# EAGLE schematic A314-600_v1.0 (EAGLE 7.7.0)

## Sheet 1 of 5: AMIGA Interface
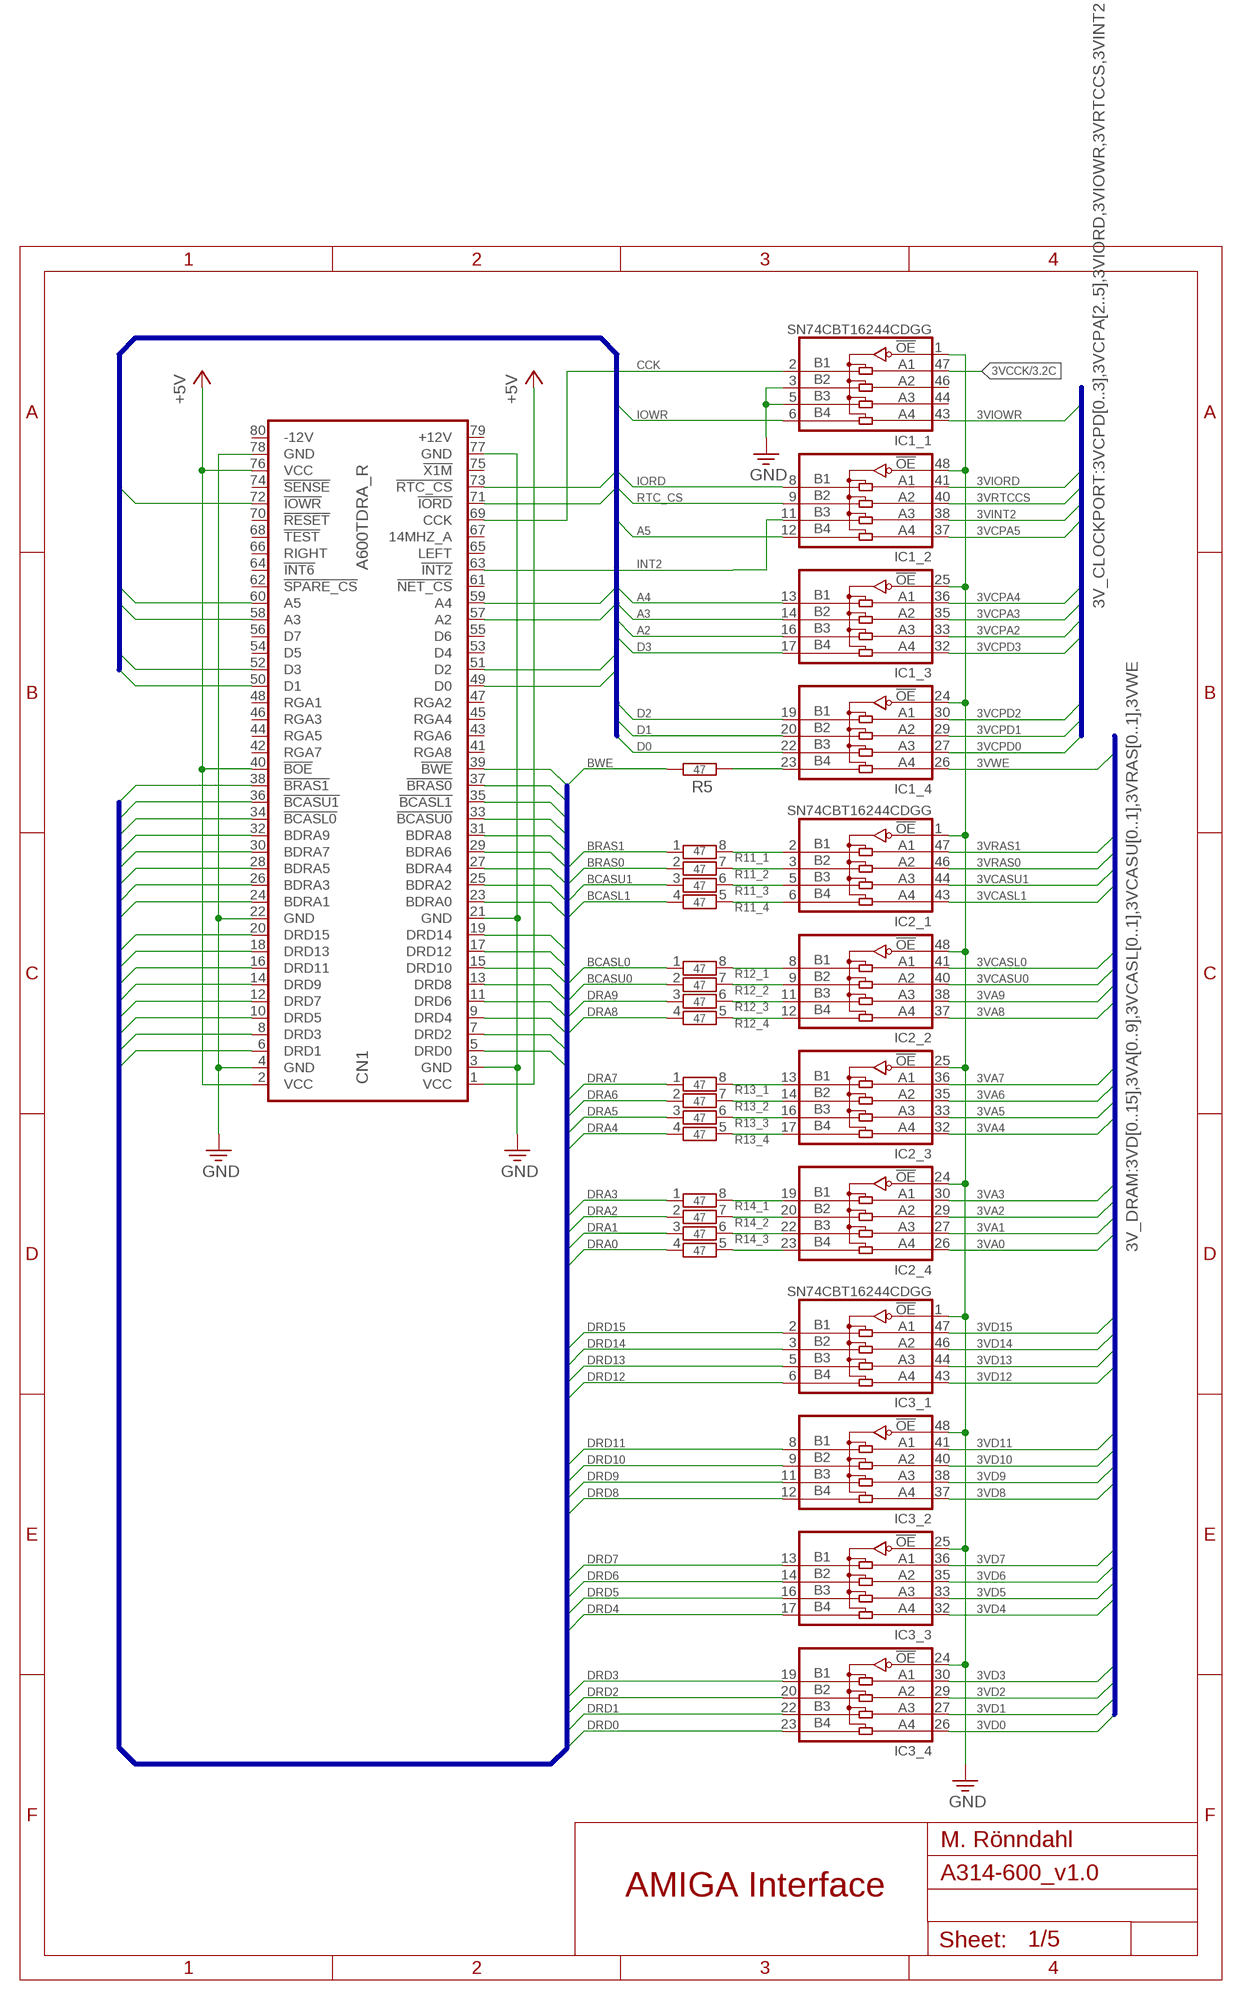
[diagram p0: schematic, sheet 1]

### Parts
CN1  A600TDRA_R  [CE-2X40_1.27_R]
IC1  SN74CBT16244CDGG  [PSOP-DGG48]
IC2  SN74CBT16244CDGG  [PSOP-DGG48]
IC3  SN74CBT16244CDGG  [PSOP-DGG48]
R5  47  R-EU_R0603  [R0603]
R11  47  CTS742C083_S  [CTS742C083]
R12  47  CTS742C083_S  [CTS742C083]
R13  47  CTS742C083_S  [CTS742C083]
R14  47  CTS742C083_S  [CTS742C083]

### Nets
3VA0: IC2.26(_4:A4) ; also sheet 3
3VA1: IC2.27(_4:A3) ; also sheet 3
3VA2: IC2.29(_4:A2) ; also sheet 3
3VA3: IC2.30(_4:A1) ; also sheet 3
3VA4: IC2.32(_3:A4) ; also sheet 3
3VA5: IC2.33(_3:A3) ; also sheet 3
3VA6: IC2.35(_3:A2) ; also sheet 3
3VA7: IC2.36(_3:A1) ; also sheet 3
3VA8: IC2.37(_2:A4) ; also sheet 3
3VA9: IC2.38(_2:A3) ; also sheet 3
3VCASL0: IC2.41(_2:A1) ; also sheet 3
3VCASL1: IC2.43(_1:A4) ; also sheet 3
3VCASU0: IC2.40(_2:A2) ; also sheet 3
3VCASU1: IC2.44(_1:A3) ; also sheet 3
3VCCK: IC1.47(_1:A1) ; also sheet 3
3VCPA2: IC1.33(_3:A3) ; also sheet 3
3VCPA3: IC1.35(_3:A2) ; also sheet 3
3VCPA4: IC1.36(_3:A1) ; also sheet 3
3VCPA5: IC1.37(_2:A4) ; also sheet 3
3VCPD0: IC1.27(_4:A3) ; also sheet 3
3VCPD1: IC1.29(_4:A2) ; also sheet 3
3VCPD2: IC1.30(_4:A1) ; also sheet 3
3VCPD3: IC1.32(_3:A4) ; also sheet 3
3VD0: IC3.26(_4:A4) ; also sheet 3
3VD1: IC3.27(_4:A3) ; also sheet 3
3VD2: IC3.29(_4:A2) ; also sheet 3
3VD3: IC3.30(_4:A1) ; also sheet 3
3VD4: IC3.32(_3:A4) ; also sheet 3
3VD5: IC3.33(_3:A3) ; also sheet 3
3VD6: IC3.35(_3:A2) ; also sheet 3
3VD7: IC3.36(_3:A1) ; also sheet 3
3VD8: IC3.37(_2:A4) ; also sheet 3
3VD9: IC3.38(_2:A3) ; also sheet 3
3VD10: IC3.40(_2:A2) ; also sheet 3
3VD11: IC3.41(_2:A1) ; also sheet 3
3VD12: IC3.43(_1:A4) ; also sheet 3
3VD13: IC3.44(_1:A3) ; also sheet 3
3VD14: IC3.46(_1:A2) ; also sheet 3
3VD15: IC3.47(_1:A1) ; also sheet 3
3VINT2: IC1.38(_2:A3) ; also sheet 3
3VIORD: IC1.41(_2:A1) ; also sheet 3
3VIOWR: IC1.43(_1:A4) ; also sheet 3
3VRAS0: IC2.46(_1:A2) ; also sheet 3
3VRAS1: IC2.47(_1:A1) ; also sheet 3
3VRTCCS: IC1.40(_2:A2) ; also sheet 3
3VWE: IC1.26(_4:A4) ; also sheet 3
+5V: CN1.1(VCC) CN1.2(VCC) CN1.40(!BOE) CN1.76(VCC) ; also sheet 3,4,5
A2: CN1.57(A2) IC1.16(_3:B3)
A3: CN1.58(A3) IC1.14(_3:B2)
A4: CN1.59(A4) IC1.13(_3:B1)
A5: CN1.60(A5) IC1.12(_2:B4)
BCASL0: CN1.34(!BCASL0) R12.1
BCASL1: CN1.35(!BCASL1) R11.4
BCASU0: CN1.33(!BCASU0) R12.2
BCASU1: CN1.36(!BCASU1) R11.3
BRAS0: CN1.37(!BRAS0) R11.2
BRAS1: CN1.38(!BRAS1) R11.1
BWE: CN1.39(!BWE) R5.1
CCK: CN1.69(CCK) IC1.2(_1:B1)
D0: CN1.49(D0) IC1.22(_4:B3)
D1: CN1.50(D1) IC1.20(_4:B2)
D2: CN1.51(D2) IC1.19(_4:B1)
D3: CN1.52(D3) IC1.17(_3:B4)
DRA0: CN1.23(BDRA0) R14.4
DRA1: CN1.24(BDRA1) R14.3
DRA2: CN1.25(BDRA2) R14.2
DRA3: CN1.26(BDRA3) R14.1
DRA4: CN1.27(BDRA4) R13.4
DRA5: CN1.28(BDRA5) R13.3
DRA6: CN1.29(BDRA6) R13.2
DRA7: CN1.30(BDRA7) R13.1
DRA8: CN1.31(BDRA8) R12.4
DRA9: CN1.32(BDRA9) R12.3
DRD0: CN1.5(DRD0) IC3.23(_4:B4)
DRD1: CN1.6(DRD1) IC3.22(_4:B3)
DRD2: CN1.7(DRD2) IC3.20(_4:B2)
DRD3: CN1.8(DRD3) IC3.19(_4:B1)
DRD4: CN1.9(DRD4) IC3.17(_3:B4)
DRD5: CN1.10(DRD5) IC3.16(_3:B3)
DRD6: CN1.11(DRD6) IC3.14(_3:B2)
DRD7: CN1.12(DRD7) IC3.13(_3:B1)
DRD8: CN1.13(DRD8) IC3.12(_2:B4)
DRD9: CN1.14(DRD9) IC3.11(_2:B3)
DRD10: CN1.15(DRD10) IC3.9(_2:B2)
DRD11: CN1.16(DRD11) IC3.8(_2:B1)
DRD12: CN1.17(DRD12) IC3.6(_1:B4)
DRD13: CN1.18(DRD13) IC3.5(_1:B3)
DRD14: CN1.19(DRD14) IC3.3(_1:B2)
DRD15: CN1.20(DRD15) IC3.2(_1:B1)
GND: CN1.3(GND) CN1.4(GND) CN1.21(GND) CN1.22(GND) CN1.77(GND) CN1.78(GND) IC1.1(_1:!OE) IC1.3(_1:B2) IC1.5(_1:B3) IC1.24(_4:!OE) IC1.25(_3:!OE) IC1.48(_2:!OE) IC2.1(_1:!OE) IC2.24(_4:!OE) IC2.25(_3:!OE) IC2.48(_2:!OE) IC3.1(_1:!OE) IC3.24(_4:!OE) IC3.25(_3:!OE) IC3.48(_2:!OE) ; also sheet 2,3,4,5
INT2: CN1.63(!INT2) IC1.11(_2:B3)
IORD: CN1.71(!IORD) IC1.8(_2:B1)
IOWR: CN1.72(!IOWR) IC1.6(_1:B4)
N$5: IC2.23(_4:B4) R14.5
N$31: IC2.22(_4:B3) R14.6
N$32: IC2.20(_4:B2) R14.7
N$33: IC2.19(_4:B1) R14.8
N$34: IC2.17(_3:B4) R13.5
N$35: IC2.16(_3:B3) R13.6
N$42: IC2.14(_3:B2) R13.7
N$43: IC2.13(_3:B1) R13.8
N$44: IC2.12(_2:B4) R12.5
N$45: IC2.11(_2:B3) R12.6
N$46: IC2.9(_2:B2) R12.7
N$47: IC2.8(_2:B1) R12.8
N$48: IC2.6(_1:B4) R11.5
N$49: IC2.5(_1:B3) R11.6
N$50: IC2.3(_1:B2) R11.7
N$51: IC2.2(_1:B1) R11.8
N$52: IC1.23(_4:B4) R5.2
RTC_CS: CN1.73(!RTC_CS) IC1.9(_2:B2)
Unconnected: CN1.41(RGA8) CN1.42(RGA7) CN1.43(RGA6) CN1.44(RGA5) CN1.45(RGA4) CN1.46(RGA3) CN1.47(RGA2) CN1.48(RGA1) CN1.53(D4) CN1.54(D5) CN1.55(D6) CN1.56(D7) CN1.61(!NET_CS) CN1.62(!SPARE_CS) CN1.64(!INT6) CN1.65(LEFT) CN1.66(RIGHT) CN1.67(14MHZ_A) CN1.68(!TEST) CN1.70(!RESET) CN1.74(!SENSE) CN1.75(!X1M) CN1.79(+12V) CN1.80(-12V) IC1.44(_1:A3) IC1.46(_1:A2)

### Buses
CLK:A[2..5],D[0..3],IORD,IOWR,RTC_CS
MEM:DRA[0..9],DRD[0..15],BRAS[0..1],BCASU[0..1],BCASL[0..1],BWE
3V_DRAM:3VD[0..15],3VA[0..9],3VCASL[0..1],3VCASU[0..1],3VRAS[0..1],3VWE
3V_CLOCKPORT:3VCPD[0..3],3VCPA[2..5],3VIORD,3VIOWR,3VRTCCS,3VINT2

### Notes on the sheet
- M. Rönndahl
- AMIGA Interface

## Sheet 2 of 5: SRAM & RTC
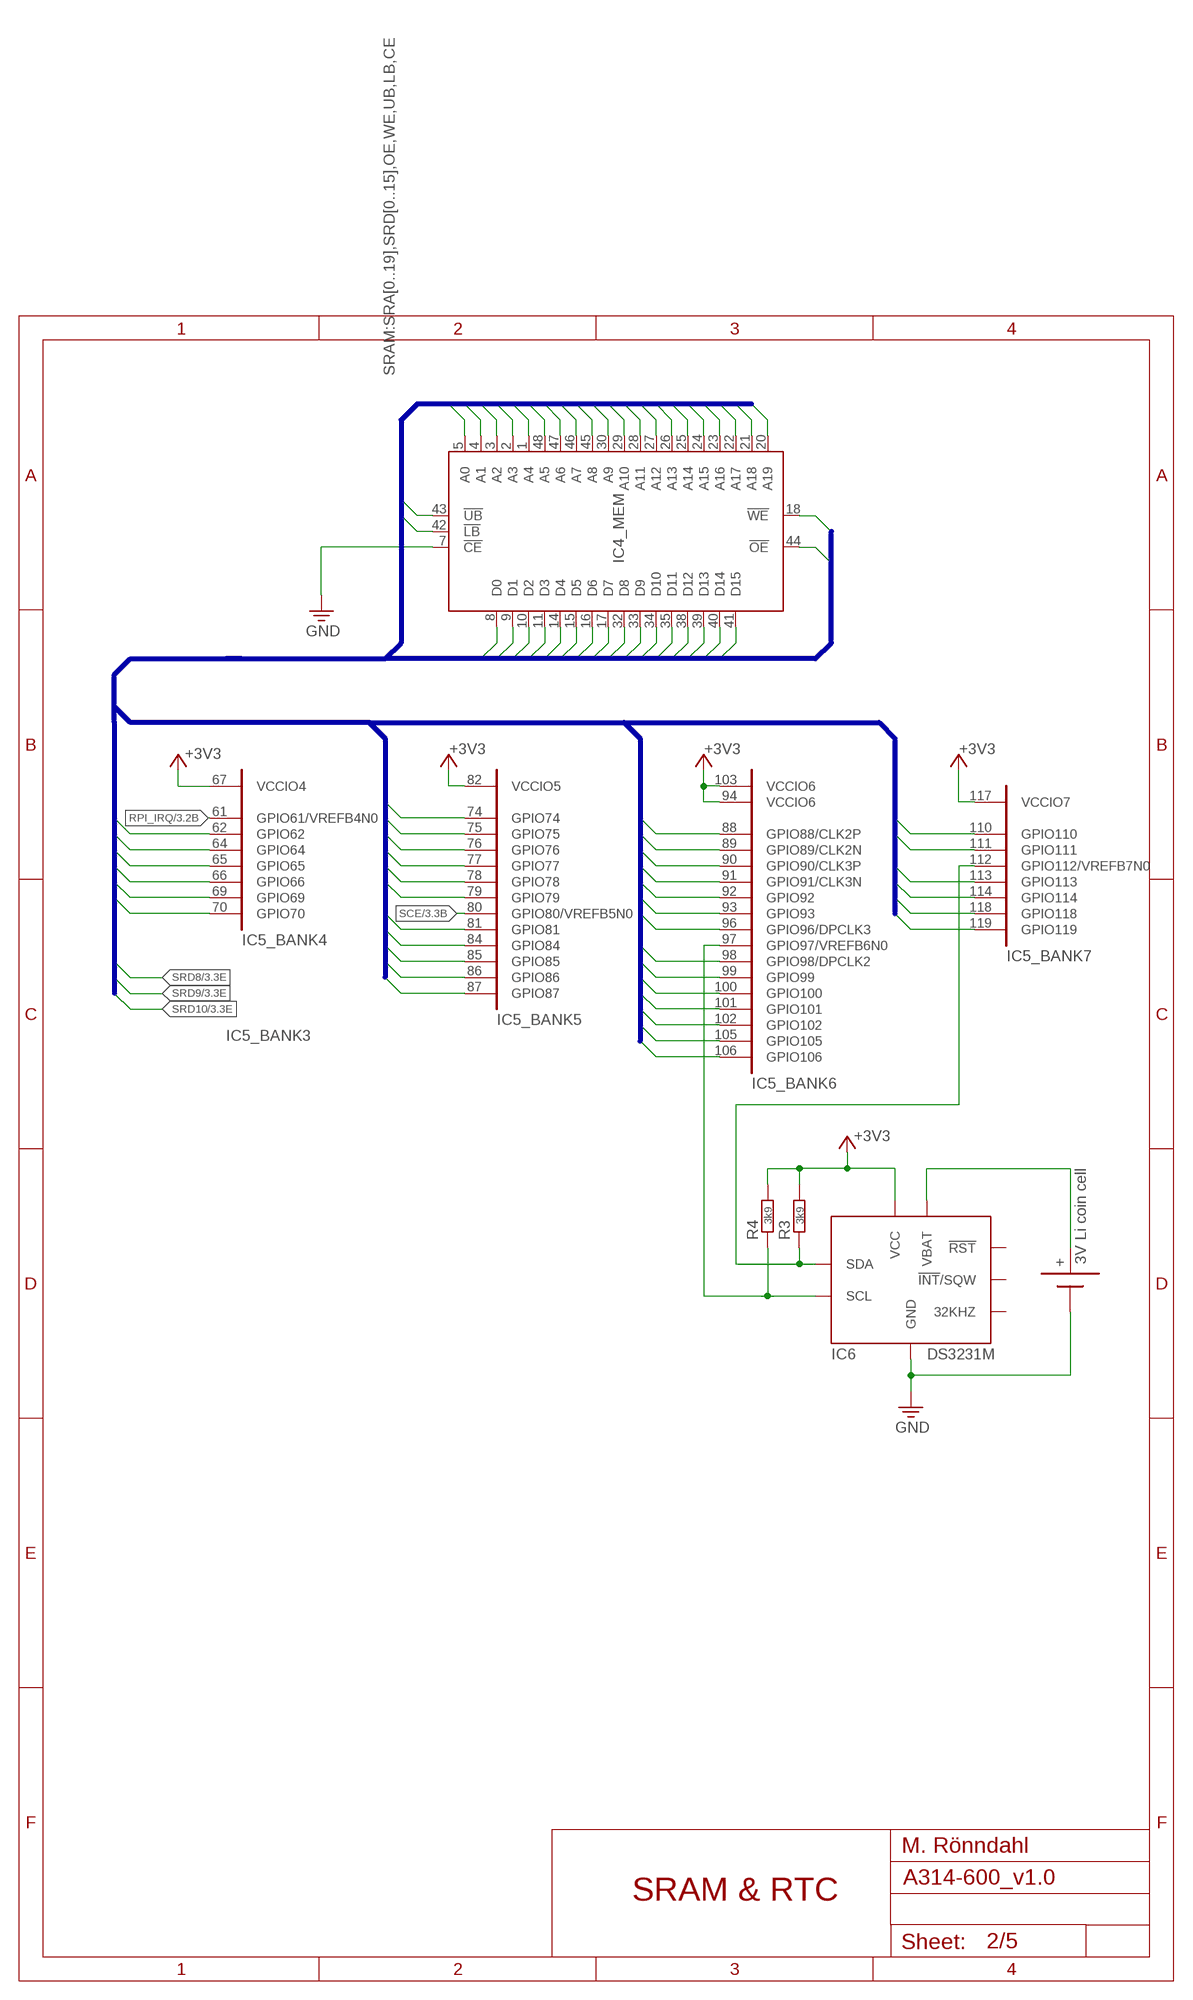
[diagram p1: schematic, sheet 2]

### Parts
BAT1  CR2025/CR2032TH  [LINX20XX-THM]
IC4  IS61WV102416FBLL-TLI  [TSOP-1_48L_12X20]
IC5  10M08SCE144  [SQFP-S-20X20-144]
IC6  DS3231M  [SOIC8]
R3  3k9  R-EU_R0603  [R0603]
R4  3k9  R-EU_R0603  [R0603]

### Nets
+: BAT1.+@1(+) BAT1.+@2(+) BAT1.+@3(+) BAT1.+@4(+) IC6.6(VBAT)
+3V3: IC5.67(_BANK4:VCCIO4) IC5.82(_BANK5:VCCIO5) IC5.94(_BANK6:VCCIO6) IC5.103(_BANK6:VCCIO6) IC5.117(_BANK7:VCCIO7) IC6.2(VCC) R3.2 R4.2 ; also sheet 3,5
GND: BAT1.GND(-) IC4.7(_MEM:!CE) IC6.5(GND) ; also sheet 1,3,4,5
LB: IC4.42(_MEM:!LB) IC5.79(_BANK5:GPIO79)
OE: IC4.44(_MEM:!OE) IC5.84(_BANK5:GPIO84)
RPI_IRQ: IC5.61(_BANK4:GPIO61/VREFB4N0) ; also sheet 3
RTC_SCL: IC5.97(_BANK6:GPIO97/VREFB6N0) IC6.8(SCL) R4.1
RTC_SDA: IC5.112(_BANK7:GPIO112/VREFB7N0) IC6.7(SDA) R3.1
SCE: IC5.80(_BANK5:GPIO80/VREFB5N0) ; also sheet 3
SRA0: IC4.5(_MEM:A0) IC5.93(_BANK6:GPIO93)
SRA1: IC4.4(_MEM:A1) IC5.92(_BANK6:GPIO92)
SRA2: IC4.3(_MEM:A2) IC5.91(_BANK6:GPIO91/CLK3N)
SRA3: IC4.2(_MEM:A3) IC5.90(_BANK6:GPIO90/CLK3P)
SRA4: IC4.1(_MEM:A4) IC5.89(_BANK6:GPIO89/CLK2N)
SRA5: IC4.48(_MEM:A5) IC5.88(_BANK6:GPIO88/CLK2P)
SRA6: IC4.47(_MEM:A6) IC5.87(_BANK5:GPIO87)
SRA7: IC4.46(_MEM:A7) IC5.86(_BANK5:GPIO86)
SRA8: IC4.45(_MEM:A8) IC5.85(_BANK5:GPIO85)
SRA9: IC4.30(_MEM:A9) IC5.62(_BANK4:GPIO62)
SRA10: IC4.29(_MEM:A10) IC5.64(_BANK4:GPIO64)
SRA11: IC4.28(_MEM:A11) IC5.65(_BANK4:GPIO65)
SRA12: IC4.27(_MEM:A12) IC5.66(_BANK4:GPIO66)
SRA13: IC4.26(_MEM:A13) IC5.69(_BANK4:GPIO69)
SRA14: IC4.25(_MEM:A14) IC5.70(_BANK4:GPIO70)
SRA15: IC4.24(_MEM:A15) IC5.110(_BANK7:GPIO110)
SRA16: IC4.23(_MEM:A16) IC5.111(_BANK7:GPIO111)
SRA17: IC4.22(_MEM:A17) IC5.113(_BANK7:GPIO113)
SRA18: IC4.21(_MEM:A18) IC5.114(_BANK7:GPIO114)
SRA19: IC4.20(_MEM:A19) IC5.118(_BANK7:GPIO118)
SRD0: IC4.8(_MEM:D0) IC5.96(_BANK6:GPIO96/DPCLK3)
SRD1: IC4.9(_MEM:D1) IC5.98(_BANK6:GPIO98/DPCLK2)
SRD2: IC4.10(_MEM:D2) IC5.99(_BANK6:GPIO99)
SRD3: IC4.11(_MEM:D3) IC5.100(_BANK6:GPIO100)
SRD4: IC4.14(_MEM:D4) IC5.101(_BANK6:GPIO101)
SRD5: IC4.15(_MEM:D5) IC5.102(_BANK6:GPIO102)
SRD6: IC4.16(_MEM:D6) IC5.105(_BANK6:GPIO105)
SRD7: IC4.17(_MEM:D7) IC5.106(_BANK6:GPIO106)
SRD8: IC4.32(_MEM:D8) ; also sheet 3
SRD9: IC4.33(_MEM:D9) ; also sheet 3
SRD10: IC4.34(_MEM:D10) ; also sheet 3
SRD11: IC4.35(_MEM:D11) IC5.74(_BANK5:GPIO74)
SRD12: IC4.38(_MEM:D12) IC5.75(_BANK5:GPIO75)
SRD13: IC4.39(_MEM:D13) IC5.76(_BANK5:GPIO76)
SRD14: IC4.40(_MEM:D14) IC5.77(_BANK5:GPIO77)
SRD15: IC4.41(_MEM:D15) IC5.78(_BANK5:GPIO78)
UB: IC4.43(_MEM:!UB) IC5.81(_BANK5:GPIO81)
WE: IC4.18(_MEM:!WE) IC5.119(_BANK7:GPIO119)
Unconnected: IC6.1(32KHZ) IC6.3(!INT!/SQW) IC6.4(!RST)

### Buses
SRAM:SRA[0..19],SRD[0..15],OE,WE,UB,LB,CE

### Notes on the sheet
- IC5_BANK3
- 3V Li coin cell
- M. Rönndahl
- SRAM & RTC

## Sheet 3 of 5: Raspberry & DRAM Bus
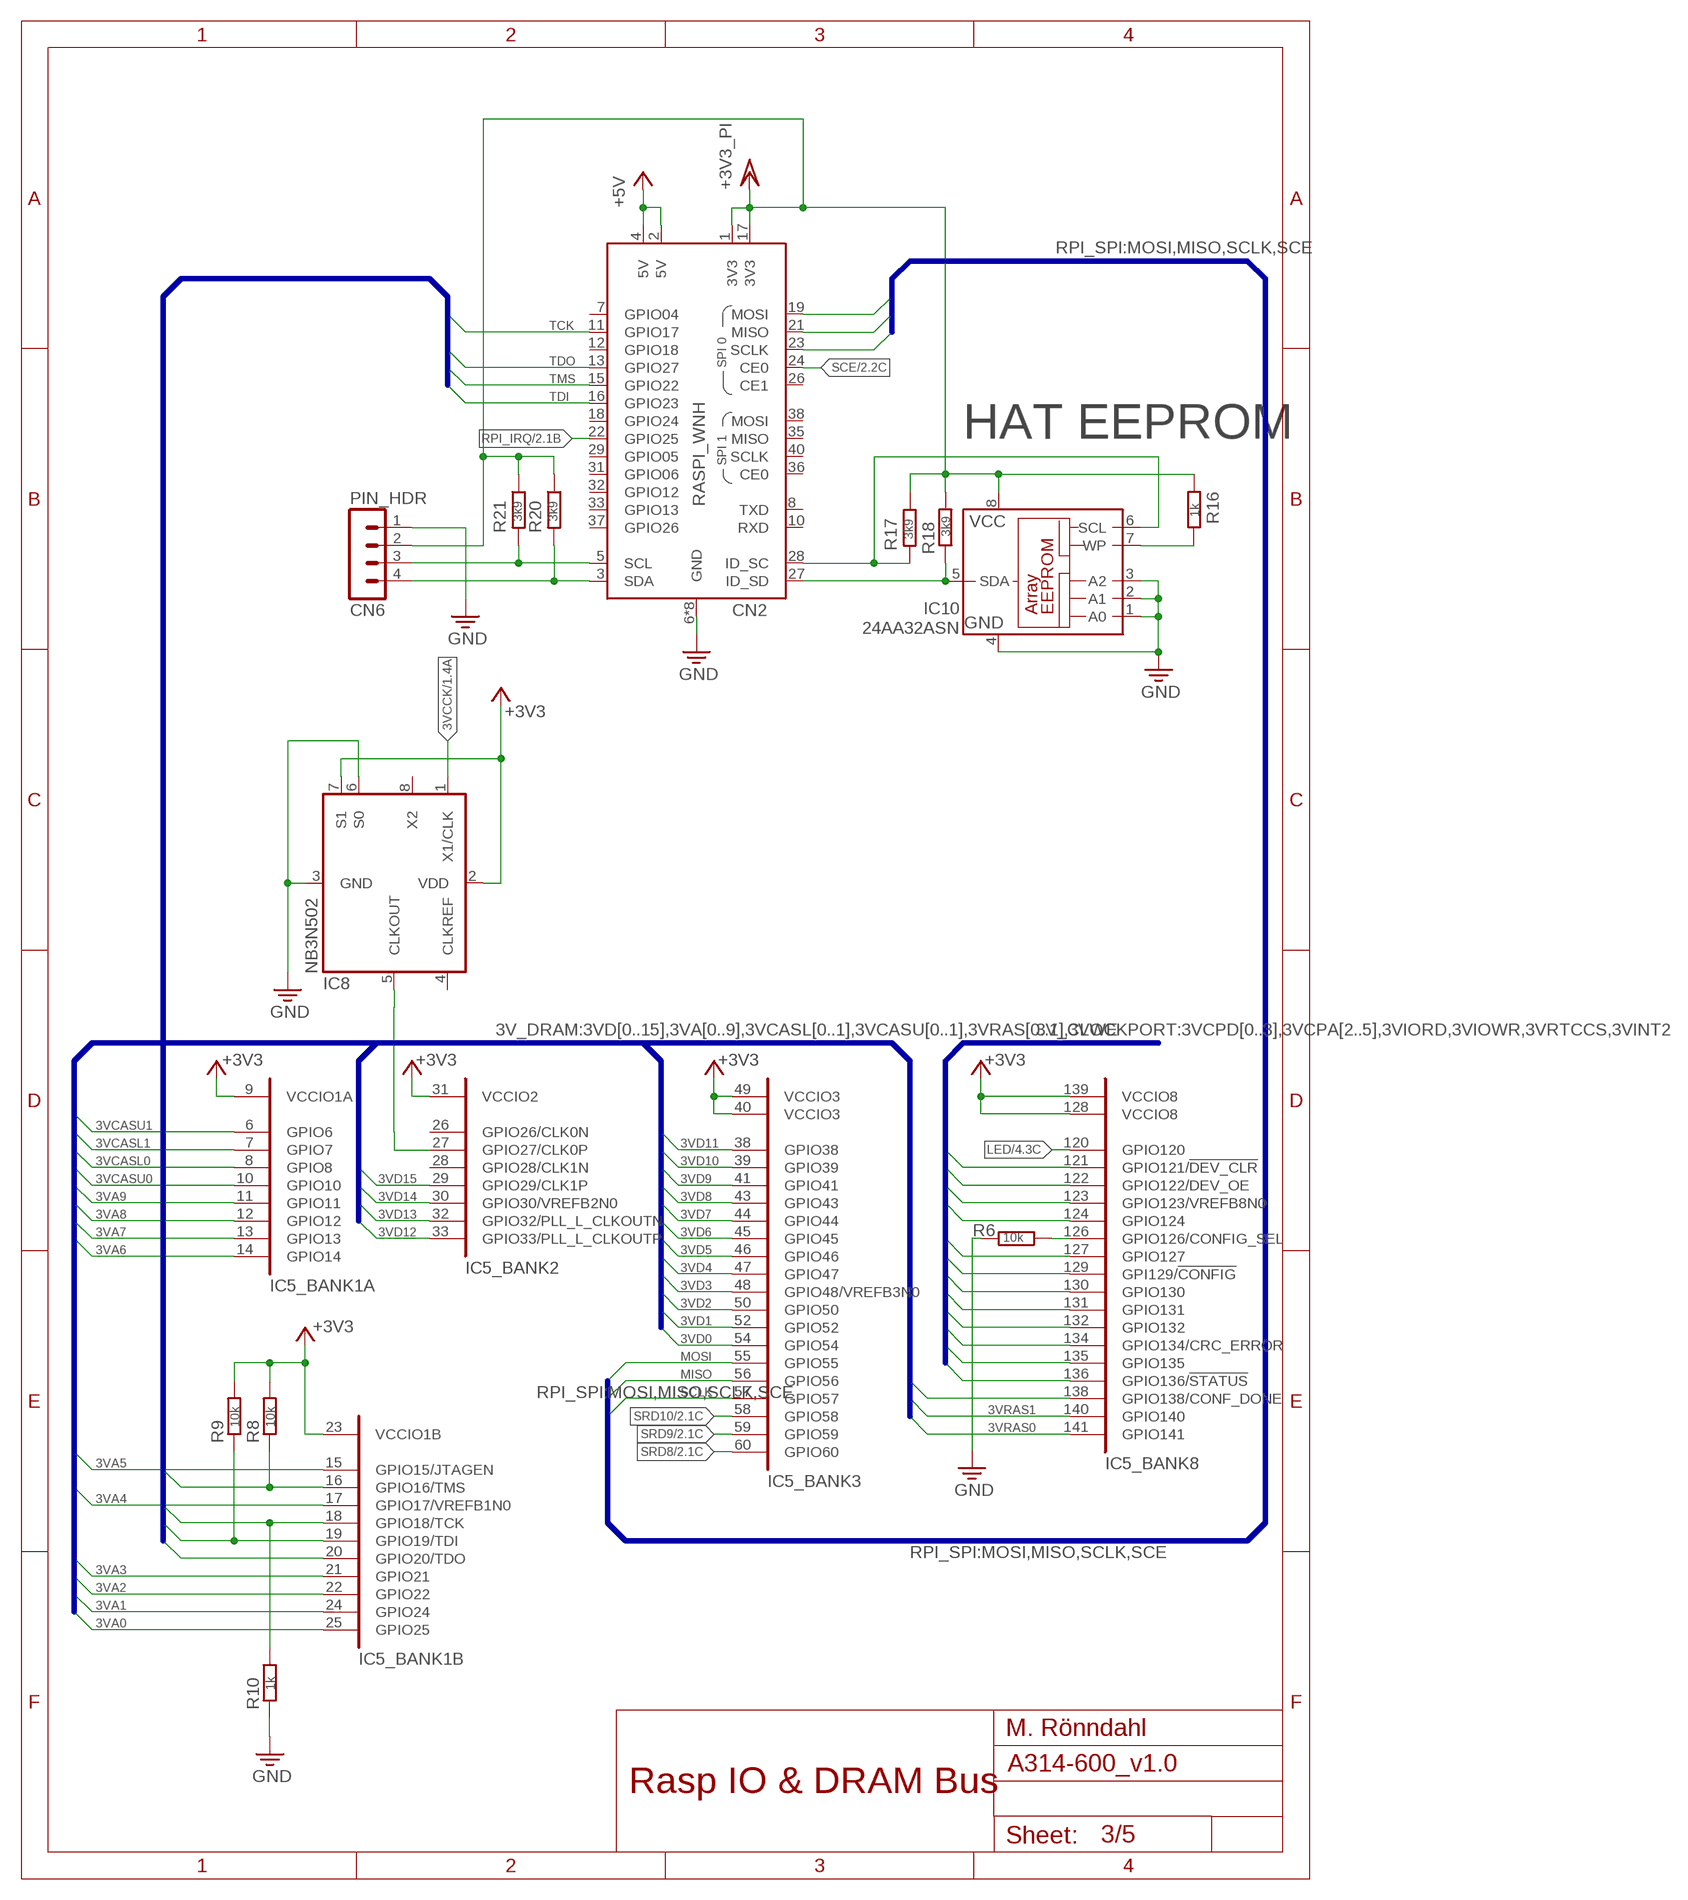
[diagram p2: schematic, sheet 3]

### Parts
CN2  RASPI_WNH  [RASPBERRYPIZEROW_NO_HOLES]
CN6  PIN_HDR  MA04-1  [MA04-1]
IC8  NB3N502  [SO08]
IC10  24AA32ASN  [SO-08]
R6  10k  R-EU_R0603  [R0603]
R8  10k  R-EU_R0603  [R0603]
R9  10k  R-EU_R0603  [R0603]
R10  1k  R-EU_R0603  [R0603]
R16  1k  R-EU_R0603  [R0603]
R17  3k9  R-EU_R0603  [R0603]
R18  3k9  R-EU_R0603  [R0603]
R20  3k9  R-EU_R0603  [R0603]
R21  3k9  R-EU_R0603  [R0603]

### Nets
3VA0: IC5.25(_BANK1B:GPIO25) ; also sheet 1
3VA1: IC5.24(_BANK1B:GPIO24) ; also sheet 1
3VA2: IC5.22(_BANK1B:GPIO22) ; also sheet 1
3VA3: IC5.21(_BANK1B:GPIO21) ; also sheet 1
3VA4: IC5.17(_BANK1B:GPIO17/VREFB1N0) ; also sheet 1
3VA5: IC5.15(_BANK1B:GPIO15/JTAGEN) ; also sheet 1
3VA6: IC5.14(_BANK1A:GPIO14) ; also sheet 1
3VA7: IC5.13(_BANK1A:GPIO13) ; also sheet 1
3VA8: IC5.12(_BANK1A:GPIO12) ; also sheet 1
3VA9: IC5.11(_BANK1A:GPIO11) ; also sheet 1
3VCASL0: IC5.8(_BANK1A:GPIO8) ; also sheet 1
3VCASL1: IC5.7(_BANK1A:GPIO7) ; also sheet 1
3VCASU0: IC5.10(_BANK1A:GPIO10) ; also sheet 1
3VCASU1: IC5.6(_BANK1A:GPIO6) ; also sheet 1
3VCCK: IC8.1(X1/CLK) ; also sheet 1
3VCPA2: IC5.131(_BANK8:GPIO131) ; also sheet 1
3VCPA3: IC5.130(_BANK8:GPIO130) ; also sheet 1
3VCPA4: IC5.129(_BANK8:GPI129/!CONFIG) ; also sheet 1
3VCPA5: IC5.127(_BANK8:GPIO127) ; also sheet 1
3VCPD0: IC5.136(_BANK8:GPIO136/!STATUS) ; also sheet 1
3VCPD1: IC5.135(_BANK8:GPIO135) ; also sheet 1
3VCPD2: IC5.134(_BANK8:GPIO134/CRC_ERROR) ; also sheet 1
3VCPD3: IC5.132(_BANK8:GPIO132) ; also sheet 1
3VD0: IC5.54(_BANK3:GPIO54) ; also sheet 1
3VD1: IC5.52(_BANK3:GPIO52) ; also sheet 1
3VD2: IC5.50(_BANK3:GPIO50) ; also sheet 1
3VD3: IC5.48(_BANK3:GPIO48/VREFB3N0) ; also sheet 1
3VD4: IC5.47(_BANK3:GPIO47) ; also sheet 1
3VD5: IC5.46(_BANK3:GPIO46) ; also sheet 1
3VD6: IC5.45(_BANK3:GPIO45) ; also sheet 1
3VD7: IC5.44(_BANK3:GPIO44) ; also sheet 1
3VD8: IC5.43(_BANK3:GPIO43) ; also sheet 1
3VD9: IC5.41(_BANK3:GPIO41) ; also sheet 1
3VD10: IC5.39(_BANK3:GPIO39) ; also sheet 1
3VD11: IC5.38(_BANK3:GPIO38) ; also sheet 1
3VD12: IC5.33(_BANK2:GPIO33/PLL_L_CLKOUTP) ; also sheet 1
3VD13: IC5.32(_BANK2:GPIO32/PLL_L_CLKOUTN) ; also sheet 1
3VD14: IC5.30(_BANK2:GPIO30/VREFB2N0) ; also sheet 1
3VD15: IC5.29(_BANK2:GPIO29/CLK1P) ; also sheet 1
3VINT2: IC5.124(_BANK8:GPIO124) ; also sheet 1
3VIORD: IC5.122(_BANK8:GPIO122/DEV_OE) ; also sheet 1
3VIOWR: IC5.121(_BANK8:GPIO121/!DEV_CLR) ; also sheet 1
3VRAS0: IC5.141(_BANK8:GPIO141) ; also sheet 1
3VRAS1: IC5.140(_BANK8:GPIO140) ; also sheet 1
3VRTCCS: IC5.123(_BANK8:GPIO123/VREFB8N0) ; also sheet 1
3VWE: IC5.138(_BANK8:GPIO138/CONF_DONE) ; also sheet 1
14MHZ: IC5.27(_BANK2:GPIO27/CLK0P) IC8.5(CLKOUT)
+3V3: IC5.9(_BANK1A:VCCIO1A) IC5.23(_BANK1B:VCCIO1B) IC5.31(_BANK2:VCCIO2) IC5.40(_BANK3:VCCIO3) IC5.49(_BANK3:VCCIO3) IC5.128(_BANK8:VCCIO8) IC5.139(_BANK8:VCCIO8) IC8.2(VDD) IC8.7(S1) R8.2 R9.2 ; also sheet 2,5
+5V: CN2.2(5V) CN2.4(5V) ; also sheet 1,4,5
CONF_SEL: IC5.126(_BANK8:GPIO126/CONFIG_SEL) R6.1
GND: CN2.6(GND) CN2.9(GND) CN2.14(GND) CN2.20(GND) CN2.25(GND) CN2.30(GND) CN2.34(GND) CN2.39(GND) CN6.1 IC8.3(GND) IC8.6(S0) IC10.1(A0) IC10.2(A1) IC10.3(A2) IC10.4(GND) R6.2 R10.1 ; also sheet 1,2,4,5
HAT_SCL: CN2.28(ID_SC) IC10.6(SCL) R17.2
HAT_SDA: CN2.27(ID_SD) IC10.5(SDA) R18.1
LED: IC5.120(_BANK8:GPIO120) ; also sheet 4
MISO: CN2.21(MISO) IC5.56(_BANK3:GPIO56)
MOSI: CN2.19(MOSI) IC5.55(_BANK3:GPIO55)
PI_SCL: CN2.5(SCL) CN6.3 R21.2
PI_SDA: CN2.3(SDA) CN6.4 R20.2
RPI_IRQ: CN2.22(GPIO25) ; also sheet 2
SCE: CN2.24(CE0) ; also sheet 2
SCLK: CN2.23(SCLK) IC5.57(_BANK3:GPIO57)
SRD8: IC5.60(_BANK3:GPIO60) ; also sheet 2
SRD9: IC5.59(_BANK3:GPIO59) ; also sheet 2
SRD10: IC5.58(_BANK3:GPIO58) ; also sheet 2
TCK: CN2.11(GPIO17) IC5.18(_BANK1B:GPIO18/TCK) R10.2
TDI: CN2.16(GPIO23) IC5.19(_BANK1B:GPIO19/TDI) R9.1
TDO: CN2.13(GPIO27) IC5.20(_BANK1B:GPIO20/TDO)
TMS: CN2.15(GPIO22) IC5.16(_BANK1B:GPIO16/TMS) R8.1
VCC/2: CN2.1(3V3) CN2.17(3V3) CN6.2 IC10.8(VCC) R16.2 R17.1 R18.2 R20.1 R21.1 ; supply symbol labelled +3V3_PI ; also sheet 5
WP: IC10.7(WP) R16.1
Unconnected: CN2.7(GPIO04) CN2.8(TXD) CN2.10(RXD) CN2.12(GPIO18) CN2.18(GPIO24) CN2.26(CE1) CN2.29(GPIO05) CN2.31(GPIO06) CN2.32(GPIO12) CN2.33(GPIO13) CN2.35(MISO) CN2.36(CE0) CN2.37(GPIO26) CN2.38(MOSI) CN2.40(SCLK) IC5.26(_BANK2:GPIO26/CLK0N) IC5.28(_BANK2:GPIO28/CLK1N) IC8.4(CLKREF) IC8.8(X2)

### Buses
RPI_SPI:MOSI,MISO,SCLK,SCE
3V_CLOCKPORT:3VCPD[0..3],3VCPA[2..5],3VIORD,3VIOWR,3VRTCCS,3VINT2
3V_DRAM:3VD[0..15],3VA[0..9],3VCASL[0..1],3VCASU[0..1],3VRAS[0..1],3VWE
JTAG:TMS,TCK,TDI,TDO

### Notes on the sheet
- HAT EEPROM
- M. Rönndahl
- Rasp IO & DRAM Bus

## Sheet 4 of 5: LED Board
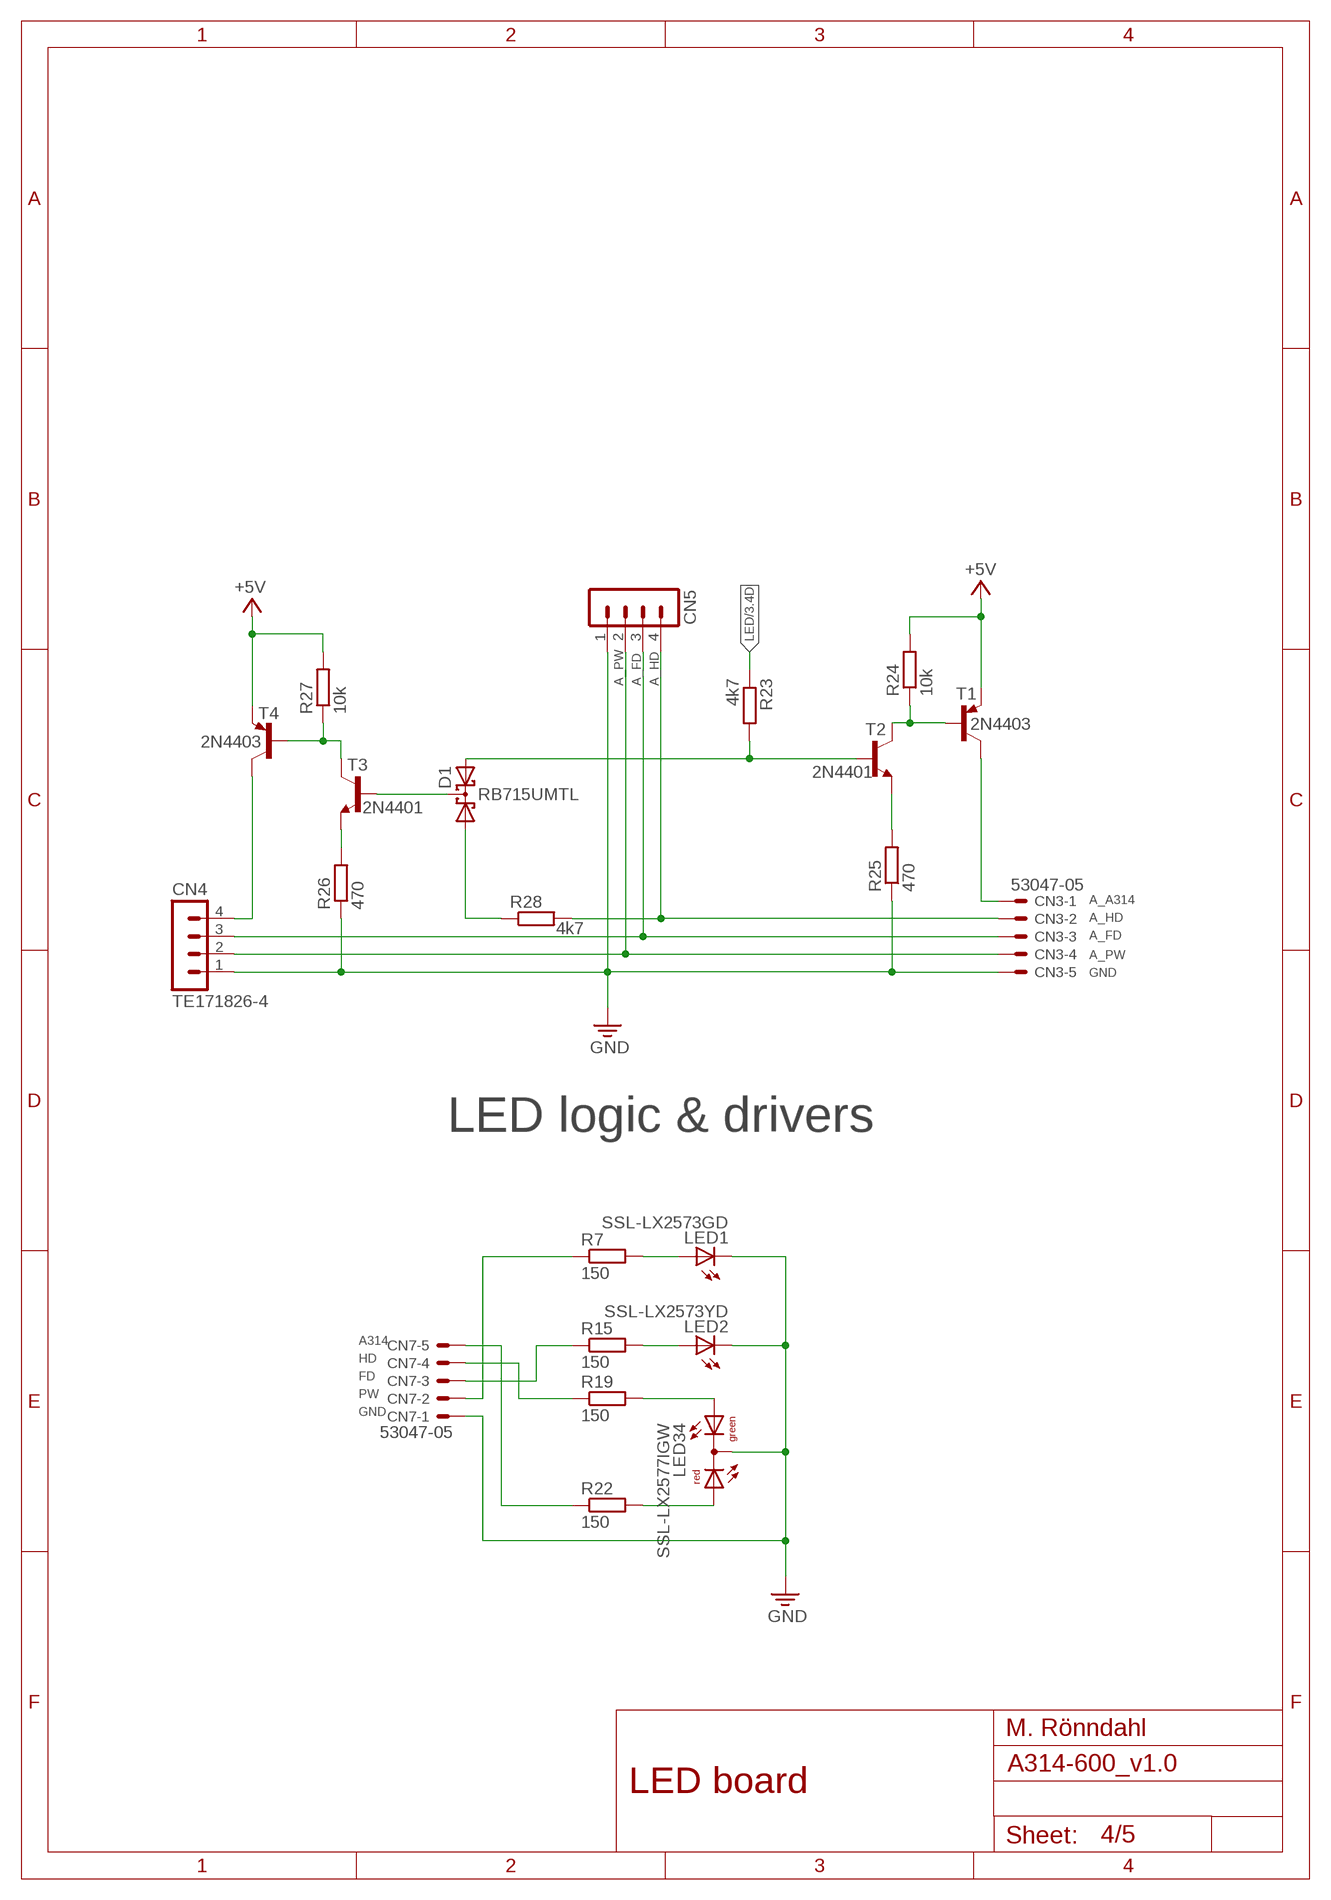
[diagram p3: schematic, sheet 4]

### Parts
CN3  53047-05  [53047-05]
CN4  TE171826-4  [FLOPPY_PWR]
CN5  MA04-1  [MA04-1]
CN7  53047-05  [53047-05]
D1  RB715UMTL  BAS40-05  [SOT23]
LED1  SSL-LX2573GD  LEDSQR2X5  [LED2X5]
LED2  SSL-LX2573YD  LEDSQR2X5  [LED2X5]
LED34  SSL-LX2577IGW  DUOLED2X5  [DUOLED2X5]
R7  150  R-EU_R0603  [R0603]
R15  150  R-EU_R0603  [R0603]
R19  150  R-EU_R0603  [R0603]
R22  150  R-EU_R0603  [R0603]
R23  4k7  R-EU_R0603  [R0603]
R24  10k  R-EU_R0603  [R0603]
R25  470  R-EU_R0603  [R0603]
R26  470  R-EU_R0603  [R0603]
R27  10k  R-EU_R0603  [R0603]
R28  4k7  R-EU_R0603  [R0603]
T1  2N4403  MMBT4403LT1-PNP-SOT23-BEC  [SOT23-BEC]
T2  2N4401  MMBT4401LT1-NPN-SOT23-BEC  [SOT23-BEC]
T3  2N4401  MMBT4401LT1-NPN-SOT23-BEC  [SOT23-BEC]
T4  2N4403  MMBT4403LT1-PNP-SOT23-BEC  [SOT23-BEC]

### Nets
+5V: R24.2 R27.2 T1.E T4.E ; also sheet 1,3,5
A314: CN7.5 R22.1
A_314: CN4.4 T4.C
A_A314: CN3.1 T1.C
A_FD: CN3.3 CN4.3 CN5.3
A_HD: CN3.2 CN5.4 R28.2
A_PW: CN3.4 CN4.2 CN5.2
FD: CN7.3 R15.1
GND: CN3.5 CN4.1 CN5.1 CN7.1 LED1.K(C) LED2.K(C) LED34.K(C) R25.1 R26.1 ; also sheet 1,2,3,5
HD: CN7.4 R19.1
LED: R23.1 ; also sheet 3
N$3: LED1.A R7.2
N$6: LED2.A R15.2
N$7: D1.3(C) T3.B
N$9: D1.1(A1) R28.1
N$36: LED34.AG R19.2
N$37: LED34.AR R22.2
N$39: R25.2 T2.E
N$41: R24.1 T1.B T2.C
N$53: R26.2 T3.E
N$54: R27.1 T3.C T4.B
PW: CN7.2 R7.1
R24_LED: D1.2(A2) R23.2 T2.B

### Notes on the sheet
- LED logic & drivers
- M. Rönndahl
- LED board

## Sheet 5 of 5: Power and decoupling
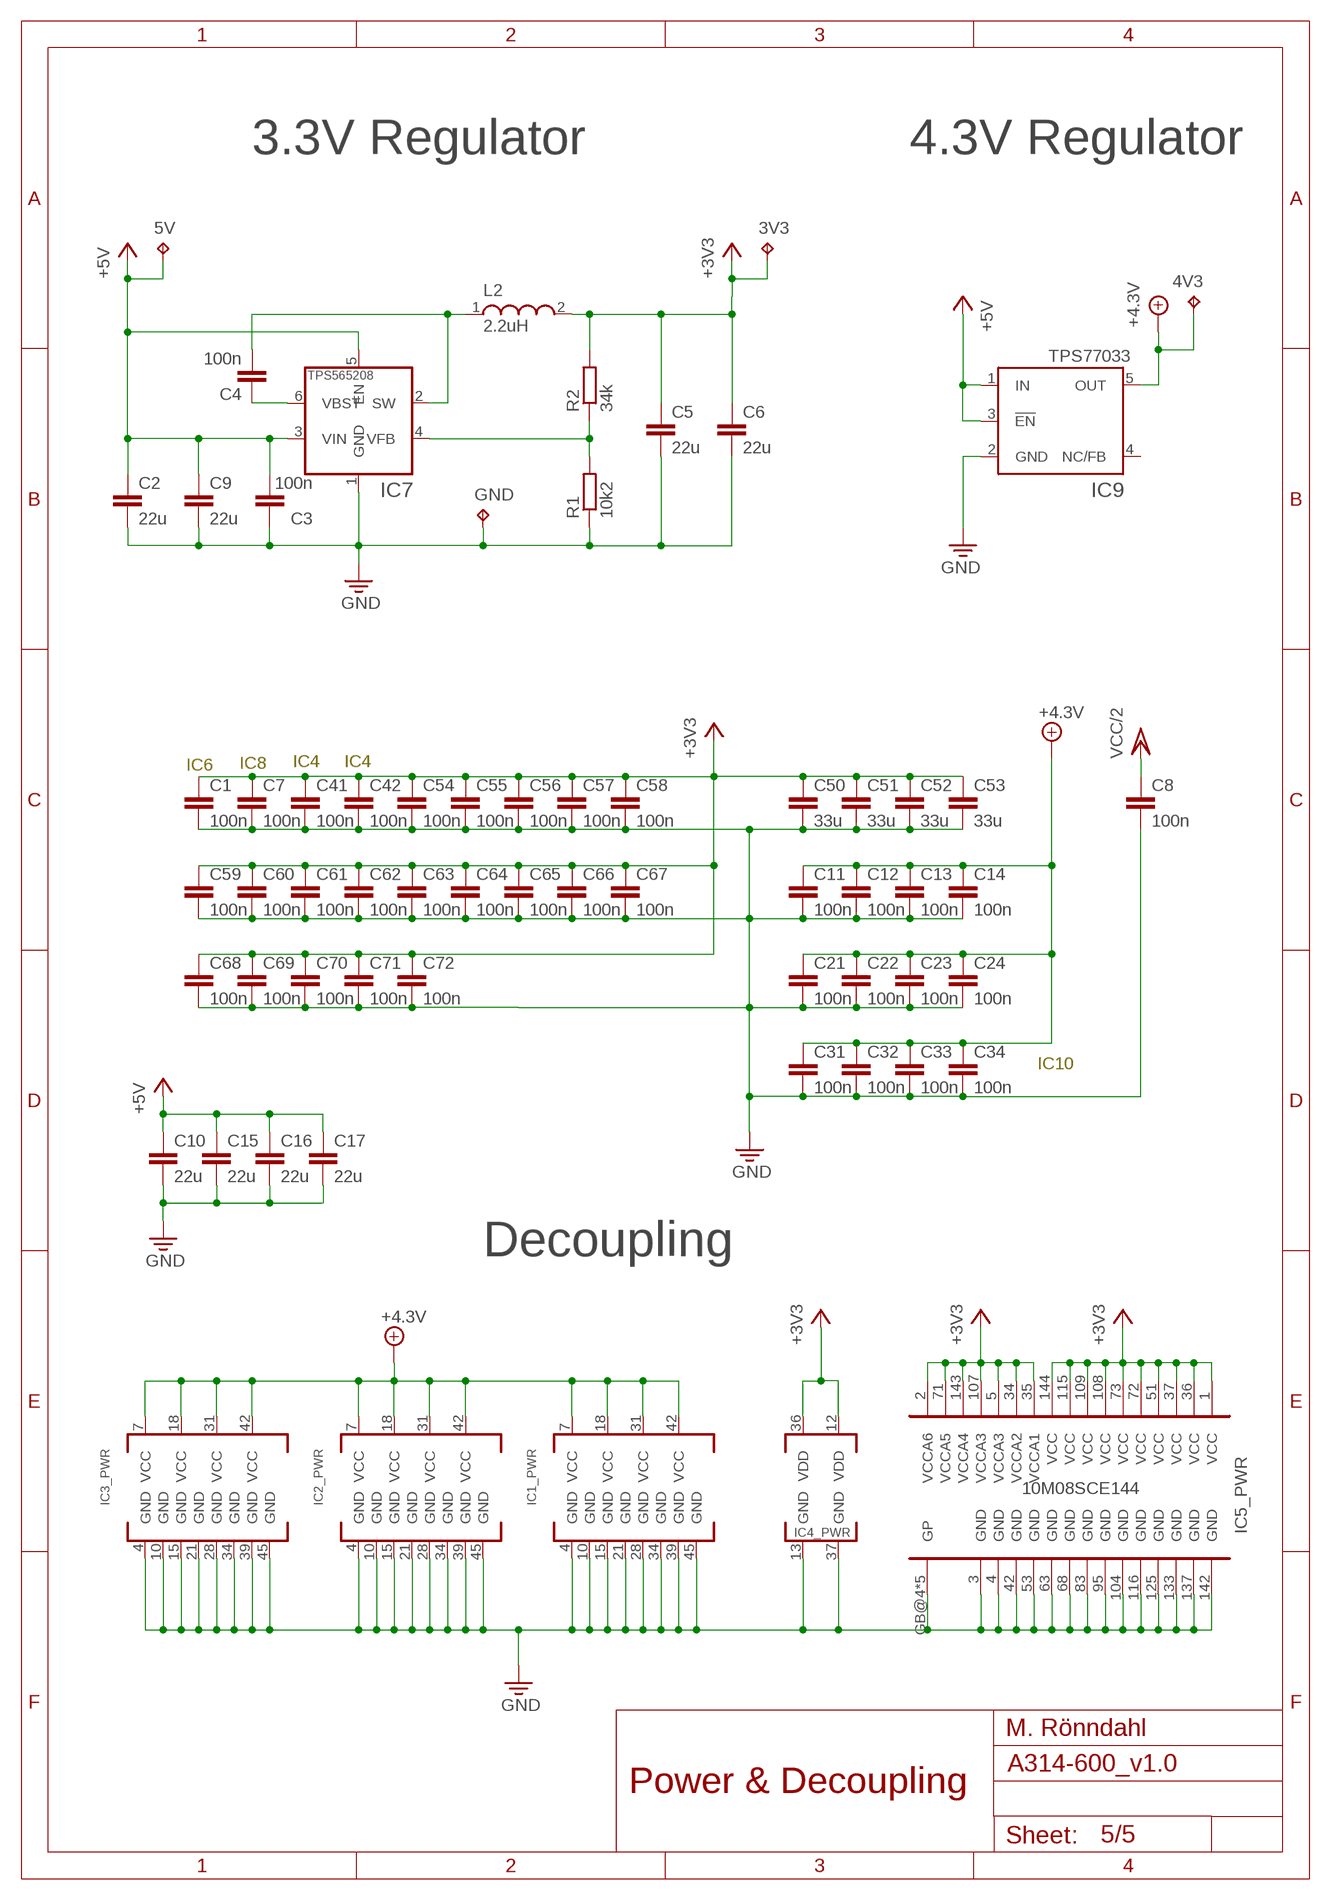
[diagram p4: schematic, sheet 5]

### Parts
3V3  TPPAD1-13  [P1-13]
4V3  TPPAD1-13  [P1-13]
5V  TPPAD1-13  [P1-13]
C1  100n  C-EUC0603  [C0603]
C2  22u  C-EUC0805  [C0805]
C3  100n  C-EUC0603  [C0603]
C4  100n  C-EUC0603  [C0603]
C5  22u  C-EUC0805  [C0805]
C6  22u  C-EUC0805  [C0805]
C7  100n  C-EUC0603  [C0603]
C8  100n  C-EUC0603  [C0603]
C9  22u  C-EUC0805  [C0805]
C10  22u  C-EUC0805  [C0805]
C11  100n  C-EUC0603  [C0603]
C12  100n  C-EUC0603  [C0603]
C13  100n  C-EUC0603  [C0603]
C14  100n  C-EUC0603  [C0603]
C15  22u  C-EUC0805  [C0805]
C16  22u  C-EUC0805  [C0805]
C17  22u  C-EUC0805  [C0805]
C21  100n  C-EUC0603  [C0603]
C22  100n  C-EUC0603  [C0603]
C23  100n  C-EUC0603  [C0603]
C24  100n  C-EUC0603  [C0603]
C31  100n  C-EUC0603  [C0603]
C32  100n  C-EUC0603  [C0603]
C33  100n  C-EUC0603  [C0603]
C34  100n  C-EUC0603  [C0603]
C41  100n  C-EUC0603  [C0603]
C42  100n  C-EUC0603  [C0603]
C50  33u  C-EUC0805  [C0805]
C51  33u  C-EUC0805  [C0805]
C52  33u  C-EUC0805  [C0805]
C53  33u  C-EUC0805  [C0805]
C54  100n  C-EUC0603  [C0603]
C55  100n  C-EUC0603  [C0603]
C56  100n  C-EUC0603  [C0603]
C57  100n  C-EUC0603  [C0603]
C58  100n  C-EUC0603  [C0603]
C59  100n  C-EUC0603  [C0603]
C60  100n  C-EUC0603  [C0603]
C61  100n  C-EUC0603  [C0603]
C62  100n  C-EUC0603  [C0603]
C63  100n  C-EUC0603  [C0603]
C64  100n  C-EUC0603  [C0603]
C65  100n  C-EUC0603  [C0603]
C66  100n  C-EUC0603  [C0603]
C67  100n  C-EUC0603  [C0603]
C68  100n  C-EUC0603  [C0603]
C69  100n  C-EUC0603  [C0603]
C70  100n  C-EUC0603  [C0603]
C71  100n  C-EUC0603  [C0603]
C72  100n  C-EUC0603  [C0603]
GND  TPPAD1-13  [P1-13]
IC7  TPS565208  TPS565208DDC  [THIN_SO23]
IC9  TPS77033  [SOT23-DBV]
L2  2.2uH  WE-TPC_1028/1038  [WE-TPC_1028/1038]
R1  10k2  R-EU_R0603  [R0603]
R2  34k  R-EU_R0603  [R0603]

### Nets
+3V3: 3V3.TP C1.1 C5.1 C6.1 C7.1 C41.1 C42.1 C50.1 C51.1 C52.1 C53.1 C54.1 C55.1 C56.1 C57.1 C58.1 C59.1 C60.1 C61.1 C62.1 C63.1 C64.1 C65.1 C66.1 C67.1 C68.1 C69.1 C70.1 C71.1 C72.1 IC4.12(_PWR:VDD) IC4.36(_PWR:VDD) IC5.1(_PWR:VCC) IC5.2(_PWR:VCCA6) IC5.5(_PWR:VCCA3) IC5.34(_PWR:VCCA2) IC5.35(_PWR:VCCA1) IC5.36(_PWR:VCC) IC5.37(_PWR:VCC) IC5.51(_PWR:VCC) IC5.71(_PWR:VCCA5) IC5.72(_PWR:VCC) IC5.73(_PWR:VCC) IC5.107(_PWR:VCCA3) IC5.108(_PWR:VCC) IC5.109(_PWR:VCC) IC5.115(_PWR:VCC) IC5.143(_PWR:VCCA4) IC5.144(_PWR:VCC) L2.2 R2.2 ; also sheet 2,3
+4.3V: 4V3.TP C11.1 C12.1 C13.1 C14.1 C21.1 C22.1 C23.1 C24.1 C31.1 C32.1 C33.1 C34.1 IC1.7(_PWR:VCC) IC1.18(_PWR:VCC) IC1.31(_PWR:VCC) IC1.42(_PWR:VCC) IC2.7(_PWR:VCC) IC2.18(_PWR:VCC) IC2.31(_PWR:VCC) IC2.42(_PWR:VCC) IC3.7(_PWR:VCC) IC3.18(_PWR:VCC) IC3.31(_PWR:VCC) IC3.42(_PWR:VCC) IC9.5(OUT)
+5V: 5V.TP C2.1 C3.2 C9.1 C10.1 C15.1 C16.1 C17.1 IC7.3(VIN) IC7.5(EN) IC9.1(IN) IC9.3(!EN) ; also sheet 1,3,4
BST1: C4.1 IC7.6(VBST)
FB1: IC7.4(VFB) R1.2 R2.1
GND: C1.2 C2.2 C3.1 C5.2 C6.2 C7.2 C8.2 C9.2 C10.2 C11.2 C12.2 C13.2 C14.2 C15.2 C16.2 C17.2 C21.2 C22.2 C23.2 C24.2 C31.2 C32.2 C33.2 C34.2 C41.2 C42.2 C50.2 C51.2 C52.2 C53.2 C54.2 C55.2 C56.2 C57.2 C58.2 C59.2 C60.2 C61.2 C62.2 C63.2 C64.2 C65.2 C66.2 C67.2 C68.2 C69.2 C70.2 C71.2 C72.2 GND.TP IC1.4(_PWR:GND) IC1.10(_PWR:GND) IC1.15(_PWR:GND) IC1.21(_PWR:GND) IC1.28(_PWR:GND) IC1.34(_PWR:GND) IC1.39(_PWR:GND) IC1.45(_PWR:GND) IC2.4(_PWR:GND) IC2.10(_PWR:GND) IC2.15(_PWR:GND) IC2.21(_PWR:GND) IC2.28(_PWR:GND) IC2.34(_PWR:GND) IC2.39(_PWR:GND) IC2.45(_PWR:GND) IC3.4(_PWR:GND) IC3.10(_PWR:GND) IC3.15(_PWR:GND) IC3.21(_PWR:GND) IC3.28(_PWR:GND) IC3.34(_PWR:GND) IC3.39(_PWR:GND) IC3.45(_PWR:GND) IC4.13(_PWR:GND) IC4.37(_PWR:GND) IC5.3(_PWR:GND) IC5.4(_PWR:GND) IC5.42(_PWR:GND) IC5.53(_PWR:GND) IC5.63(_PWR:GND) IC5.68(_PWR:GND) IC5.83(_PWR:GND) IC5.95(_PWR:GND) IC5.104(_PWR:GND) IC5.116(_PWR:GND) IC5.125(_PWR:GND) IC5.133(_PWR:GND) IC5.137(_PWR:GND) IC5.142(_PWR:GND) IC5.GB@4(_PWR:GP) IC5.GP@1(_PWR:GP) IC5.GP@2(_PWR:GP) IC5.GP@3(_PWR:GP) IC5.GP@5(_PWR:GP) IC7.1(GND) IC9.2(GND) R1.1 ; also sheet 1,2,3,4
SW: C4.2 IC7.2(SW) L2.1
VCC/2: C8.1 ; also sheet 3
Unconnected: IC9.4(NC/FB)

### Notes on the sheet
- 3.3V Regulator | 4.3V Regulator
- IC6 | IC8 | IC4 | IC4
- IC10
- Decoupling
- M. Rönndahl
- Power & Decoupling

## Library data of the parts
3V3 4V3 5V GND = testpad:TP: Test pad
BAT1 = bat-holder:CR2025/CR2032TH: Link technologies BAT-HLD-001-THM; MOUSER: 712-BAT-HLD-001-THM
C1 C3 C4 C7 C8 C11-C14 C21-C24 C31-C34 C41 C42 C50-C72 = rcl:C-EU: CAPACITOR, European symbol
C2 C5 C6 C9 C10 C15-C17 = rcl:C-EU: CAPACITOR, European symbol; MOUSER: 810-CGA8P1X7R1E226M
CN1 = con-various:A600TD: Amiga 600 trapdoor expansion port
CN2 = con-various:RASPI: Raspberry Pi GPIO connector with markings for the outer dimensions of the Raspberry Pi board model B+ with all major components identified
CN3 CN7 = con-molex:53?-05: CONNECTOR wire to board 1.25 mm (.049 inch) pitch header; MF: MOLEX; MPN: 53047-0510; OC_FARNELL: 9732861; OC_NEWARK: 38C9901
CN4 = con-various:TE171826-4: BERG Floppy power connector https://en.wikipedia.org/wiki/Berg_connector
CN5 = con-various:MA04-1: PIN HEADER; OC_FARNELL: unknown; OC_NEWARK: unknown
CN6 = con-lstb:MA04-1: PIN HEADER; OC_FARNELL: unknown; OC_NEWARK: unknown
D1 = diode:BAS40-05: Silicon Schottky Diodes General-purpose diode for high-speed switching
IC1-IC3 = ti-levelshift:SN74CBT16244C: 16-Bit FET Bus Switch with -2 V Undershoot Protection
IC4 = memory-issi:IS61WV102416FBLL: 1024K x 16 HIGH-SPEED ASYNCHRONOUS CMOS STATIC RAM
IC5 = FPGA-Intel:10M08SC: MAX 10 non-volatile FPGA; MOUSER: 989-10M08SCE144C8G
IC6 = i2c_clock:DS3231M: ±5ppm, I2C Real-Time Clock
IC7 = pwr-ti:TPS565208: 4.5-V to 17-V Input, 5-A Synchronous Step-Down Voltage Regulator; MOUSER: 595-TPS565208DDCR
IC8 = ONsemi:NB3N502: 14 MHz to 190 MHz PLL Clock Multiplier
IC9 = pwr-ti:TPS770*: ULTRALOW-POWER 50-mA LOW-DROPOUT LINEAR REGULATORS 50-mA Low-Dropout Regulator Source: http://focus.ti.com/lit/ds/symlink/tps77001.pdf; MF: TEXAS INSTRUMENTS; MPN: TPS77033DBVT; OC_FARNELL: 8461570; OC_NEWARK: 77C1187
IC10 = microchip:24*: Serial EEPROM I2C; MF: MICROCHIP; MPN: 24AA32A-I/SN; OC_FARNELL: 1617659; OC_NEWARK: 83C5815
L2 = Wurth_power_magnetics:WE-TPC: SMD Shielded Tiny Power Inductor Characteristics Extremely flat power inductor High current capability Magnetically shielded which results in a low leakage field Operating temperature: –40 °C to +125 °C Applications Portable power like PDA, digital camera, PCMCIA cards and displays DC/DC converter Embedded PC Mobile data gathering, telemetric <http://katalog.we-online.de/media/images/eisos/IndTPC_pf2.jpg> Details see: http://katalog.we-online.de/en/pbs/WE-TPC? Updated by Dan Xu 2014-07-11 2014 (C) Wurth Elektronik; MOUSER: 710-7440650022
LED1 LED2 = my_leds:LED: LED OSRAM: - CHIPLED LG R971, LG N971, LY N971, LG Q971, LY Q971, LO R971, LY R971 LH N974, LH R974 LS Q976, LO Q976, LY Q976 LO Q996 - Hyper CHIPLED LW Q18S LB Q993, LB Q99A, LB R99A - SideLED LS A670, LO A670, LY A670, LG A670, LP A670 LB A673, LV A673, LT A673, LW A673 LH A674 LY A675 LS A676, LA A676, LO A676, LY A676, LW A676 LS A679, LY A679, LG A679 - Hyper Micro SIDELED® LS Y876, LA Y876, LO Y876, LY Y876 LT Y87S - SmartLED LW L88C, LW L88S LB L89C, LB L89S, LG L890 LS L89K, LO L89K, LY L89K LS L896, LA L896, LO L896, LY L896 - TOPLED LS T670, LO T670, LY T670, LG T670, LP T670 LSG T670, LSP T670, LSY T670, LOP T670, LYG T670 LG T671, LOG T671, LSG T671 LB T673, LV T673, LT T673, LW T673 LH T674 LS T676, LA T676, LO T676, LY T676, LB T676, LH T676, LSB T676, LW T676 LB T67C, LV T67C, LT T67C, LS T67K, LO T67K, LY T67K, LW E67C LS E67B, LA E67B, LO E67B, LY E67B, LB E67C, LV E67C, LT E67C LW T67C LS T679, LY T679, LG T679 LS T770, LO T770, LY T770, LG T770, LP T770 LB T773, LV T773, LT T773, LW T773 LH T774 LS E675, LA E675, LY E675, LS T675 LS T776, LA T776, LO T776, LY T776, LB T776 LHGB T686 LT T68C, LB T68C - Hyper Mini TOPLED® LB M676 - Mini TOPLED Santana® LG M470 LS M47K, LO M47K, LY M47K Source: http://www.osram.convergy.de LUXEON: - LUMILED® LXK2-PW12-R00, LXK2-PW12-S00, LXK2-PW14-U00, LXK2-PW14-V00 LXK2-PM12-R00, LXK2-PM12-S00, LXK2-PM14-U00 LXK2-PE12-Q00, LXK2-PE12-R00, LXK2-PE12-S00, LXK2-PE14-T00, LXK2-PE14-U00 LXK2-PB12-K00, LXK2-PB12-L00, LXK2-PB12-M00, LXK2-PB14-N00, LXK2-PB14-P00, LXK2-PB14-Q00 LXK2-PR12-L00, LXK2-PR12-M00, LXK2-PR14-Q00, LXK2-PR14-R00 LXK2-PD12-Q00, LXK2-PD12-R00, LXK2-PD12-S00 LXK2-PH12-R00, LXK2-PH12-S00 LXK2-PL12-P00, LXK2-PL12-Q00, LXK2-PL12-R00 Source: www.luxeon.com KINGBRIGHT: KA-3528ASYC Source: www.kingbright.com
LED34 = my_leds:DUOLED2X5: DUO LED 2 colors, 2.5 x 5 mm, recangle
R1-R10 R15-R28 = rcl:R-EU_: RESISTOR, European symbol
R11-R14 = resistor-net:CTS742C083_S: Chip Resistor Array 4 Single Resistor Source: http://www.ctscorp.com/components/Datasheets/CTSChipArrayDs.pdf
T1 T4 = transistor:*-PNP-: PNP Transistror
T2 T3 = transistor:*-NPN-: NPN Transistror BF959 corrected 2008.03.06